# EasyEDA schematic SCH_TabletComputer-SurfacePi_2024-07-24.json
TITLE: Sheet_1; REV: 1.0; Date: 2024-07-22; Sheet: 1/1; Drawn By: akhil.arp2019; Company: Your Company
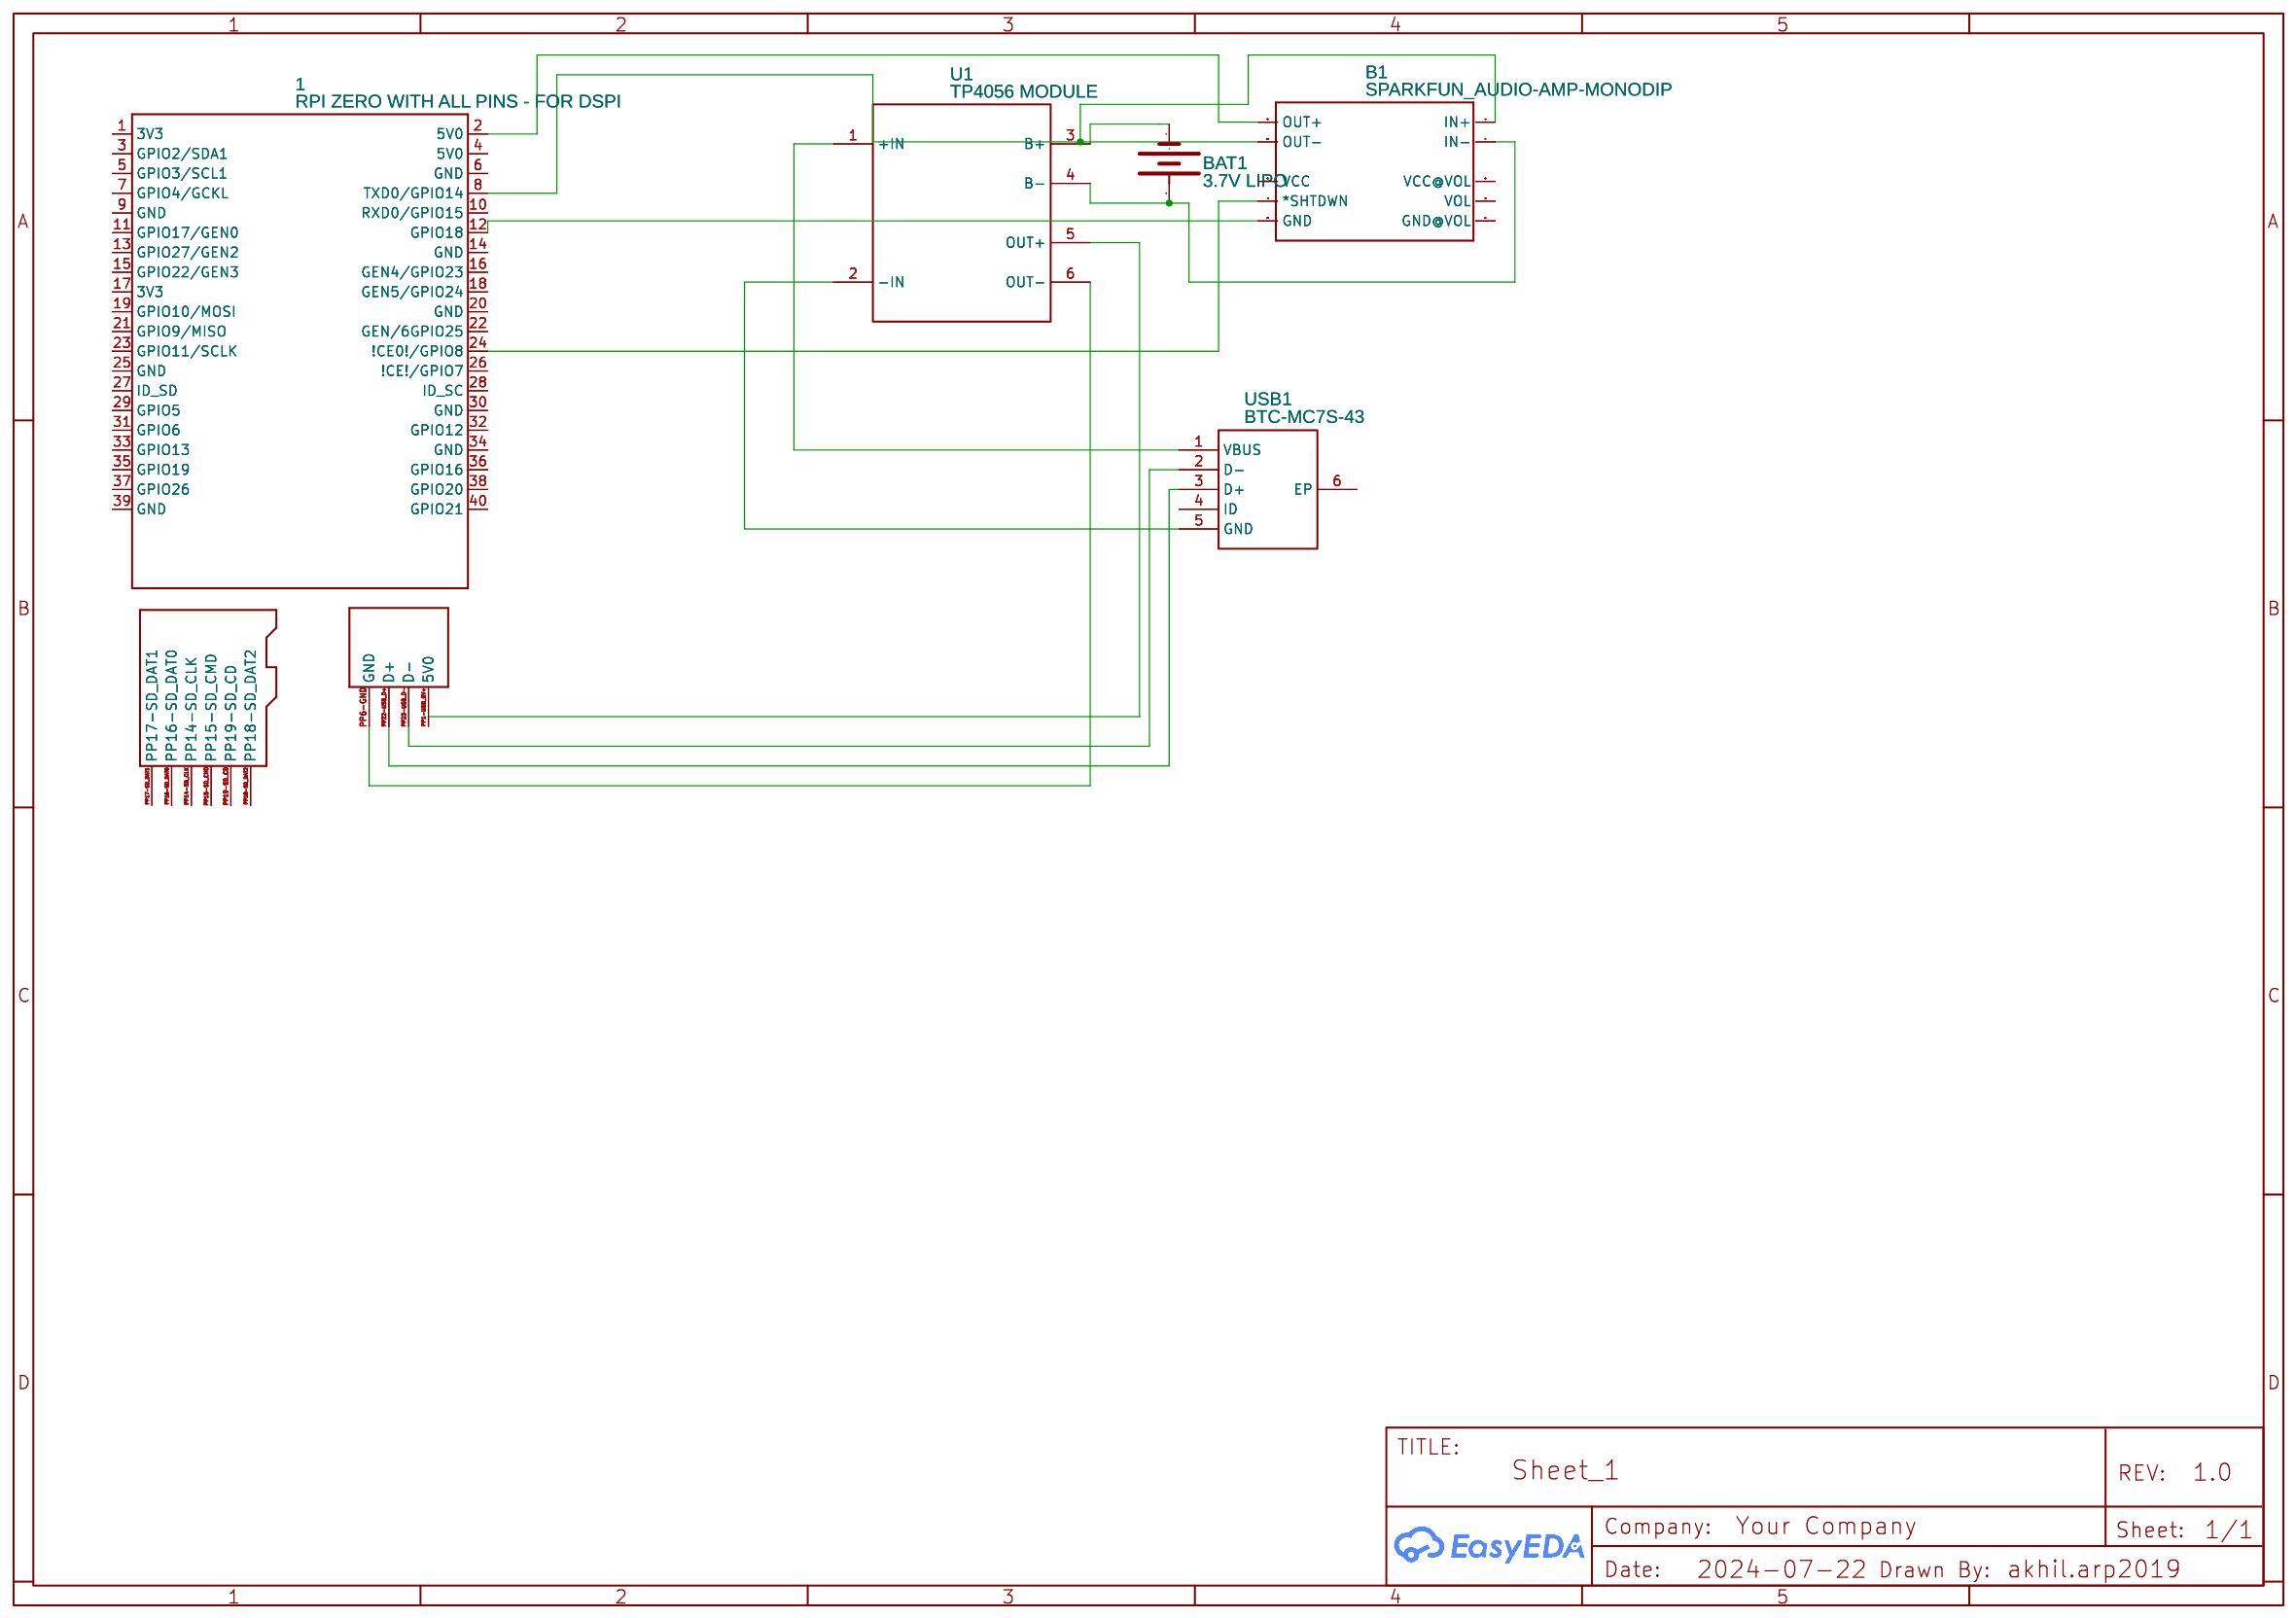
[diagram p0: schematic sheet]

## Parts
1  RPI ZERO WITH ALL PINS - FOR DSPI  [RPI-ZERO-TH-SD]
B1  SPARKFUN_AUDIO-AMP-MONODIP  [AUDIO-AMP-MONO]
BAT1  3.7V LIPO  [LIPO-110-TABS]
U1  TP4056 MODULE  [TP4056MODULE]
USB1  BTC-MC7S-43  [MICRO-USB-SMD_MICRO-USB-BTC-MC7S-43]

## Library data of the parts
1 = RPI ZERO WITH ALL PINS - FOR DSPI: Contributor: thompsonpc
B1 = SPARKFUN_AUDIO-AMP-MONODIP: Contributor: Greg Tryon
BAT1 = 3.7V LIPO: Lipo Battery Pack; Contributor: MoVitro
U1 = TP4056 MODULE: Contributor: vicur4lqx
USB1 = BTC-MC7S-43: Contributor: LCSC; Supplier: LCSC; Supplier Part: C2908218; Manufacturer: DGBZ(东莞博众); JLCPCB Part Class: Extended Part

## Nets
Net-(1-2): 1.2(5V0) B1.OUT+
Net-(1-8): 1.8(TXD0/GPIO14) B1.IN+ B1.OUT-
Net-(1-12): 1.12(GPIO18) B1.PWR-(GND)
Net-(1-24): 1.24(!CE0!/GPIO8) B1.S(*SHTDWN)
Net-(1-PP1-USB_5V+): 1.PP1-USB_5V+(5V0) U1.5(OUT+)
Net-(1-PP6-GND): 1.PP6-GND(GND) U1.6(OUT-)
Net-(1-PP22-USB_D+): 1.PP22-USB_D+(D+) USB1.3(D+)
Net-(1-PP23-USB_D-): 1.PP23-USB_D-(D-) USB1.2(D-)
Net-(B1-IN-): B1.IN- BAT1.+ U1.4(B-)
Net-(BAT1--): BAT1.- U1.3(B+)
Net-(U1-1): U1.1(+IN) USB1.1(VBUS)
Net-(U1-2): U1.2(-IN) USB1.5(GND)

Not connected (* = marked no-connect by the designer): 1 1(3V3) 3(GPIO2/SDA1) 4(5V0) 5(GPIO3/SCL1) 6(GND) 7(GPIO4/GCKL) 9(GND) 10(RXD0/GPIO15) 11(GPIO17/GEN0) 13(GPIO27/GEN2) 14(GND) 15(GPIO22/GEN3) 16(GEN4/GPIO23) 17(3V3) 18(GEN5/GPIO24) 19(GPIO10/MOSI) 20(GND) 21(GPIO9/MISO) 22(GEN/6GPIO25) 23(GPIO11/SCLK) 25(GND) 26(!CE!/GPIO7) 27(ID_SD) 28(ID_SC) 29(GPIO5) 30(GND) 31(GPIO6) 32(GPIO12) 33(GPIO13) 34(GND) 35(GPIO19) 36(GPIO16) 37(GPIO26) 38(GPIO20) 39(GND) 40(GPIO21) PP14-SD_CLK PP15-SD_CMD PP16-SD_DAT0 PP17-SD_DAT1 PP18-SD_DAT2 PP19-SD_CD; B1 PWR+(VCC) VOL VOL+(VCC@VOL) VOL-(GND@VOL); USB1 4(ID) 6(EP)
